# Altium schematic sheet MainShunt.SchDoc
size A4; SheetNumber: 1; SheetTotal: 4
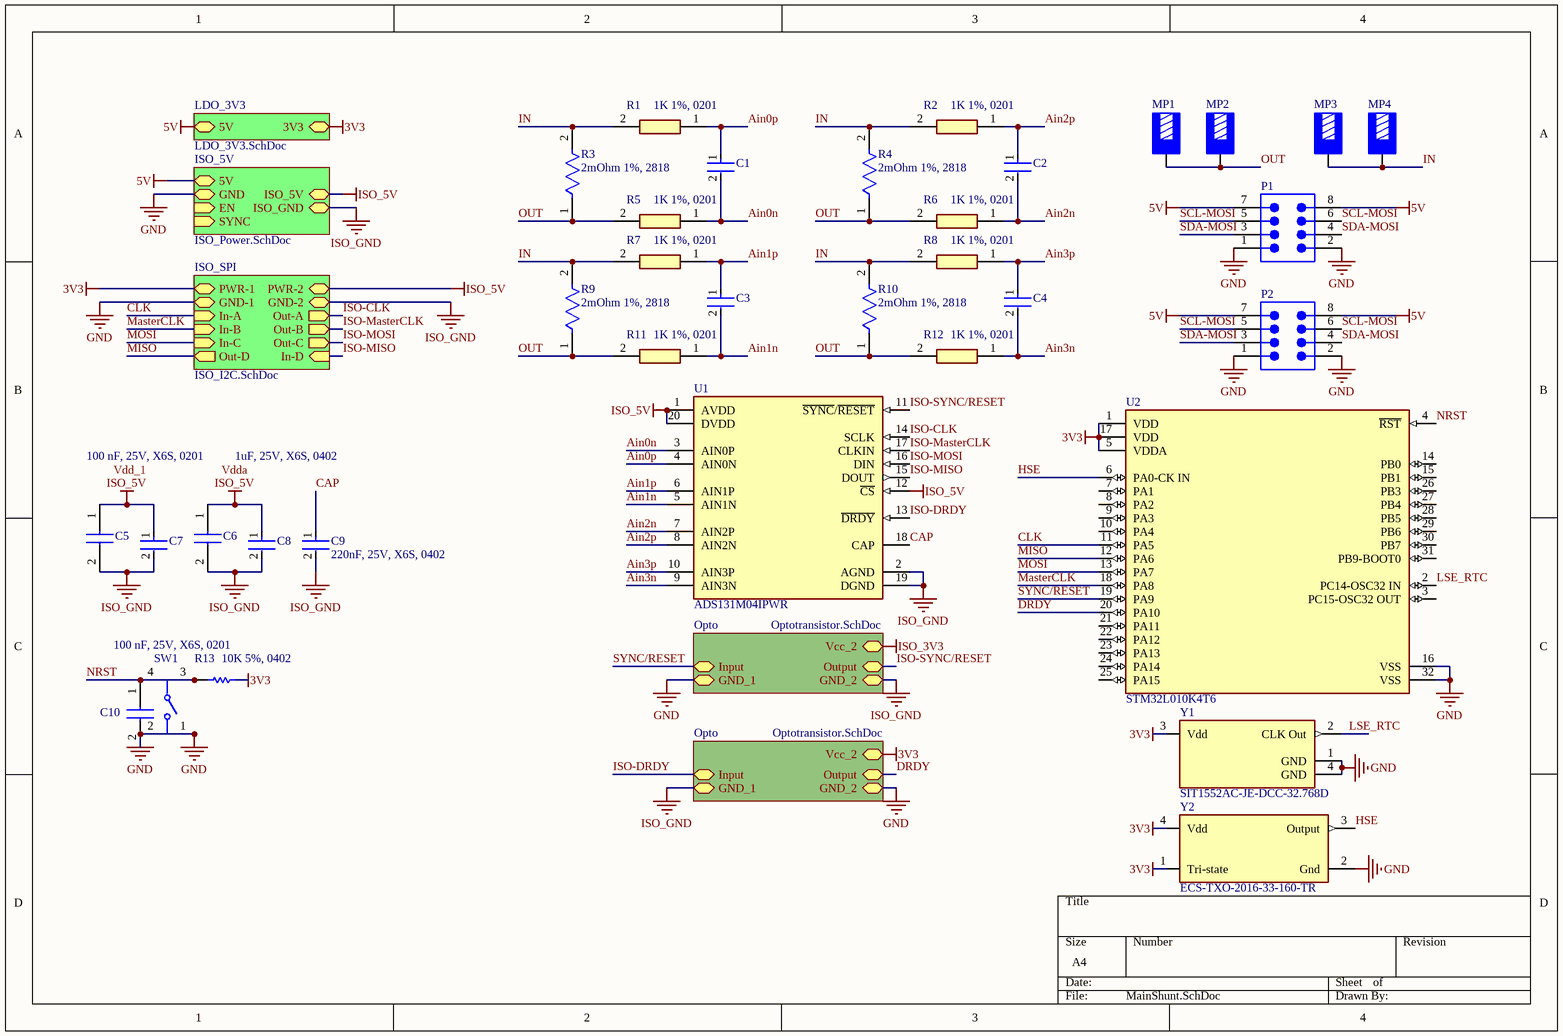
[diagram p0: MainShunt.SchDoc]

## Parts
C1  10nF, 25V, X5R, 0201  [FP-GRM033-0_03-IPC_C]  (value not drawn)
C2  10nF, 25V, X5R, 0201  [FP-GRM033-0_03-IPC_C]  (value not drawn)
C3  10nF, 25V, X5R, 0201  [FP-GRM033-0_03-IPC_C]  (value not drawn)
C4  10nF, 25V, X5R, 0201  [FP-GRM033-0_03-IPC_C]  (value not drawn)
C5  100 nF, 25V, X6S, 0201  [CAPC0603X33N]  (value not drawn)
C6  100 nF, 25V, X6S, 0201  [CAPC0603X33N]  (value not drawn)
C7  1uF, 25V, X6S, 0402  [FP-GRT155-0_1-IPC_A]  (value not drawn)
C8  1uF, 25V, X6S, 0402  [FP-GRT155-0_1-IPC_A]  (value not drawn)
C9  220nF, 25V, X6S, 0402  [FP-C0603-030-0_03-IPC_B]
C10  100 nF, 25V, X6S, 0201  [CAPC0603X33N]  (value not drawn)
MP1  7460307  [7460307_chemical surface]  (value not drawn)
MP2  7460307  [7460307_chemical surface]  (value not drawn)
MP3  7460307  [7460307_chemical surface]  (value not drawn)
MP4  7460307  [7460307_chemical surface]  (value not drawn)
P1  61200821621  [61200821621]  (value not drawn)
P2  61200821621  [61200821621]  (value not drawn)
R1  1K 1%, 0201  [ERJ1GN_(0201)]
R2  1K 1%, 0201  [ERJ1GN_(0201)]
R3  2mOhm 1%, 2818  [FP-WSHP2818-MFG]
R4  2mOhm 1%, 2818  [FP-WSHP2818-MFG]
R5  1K 1%, 0201  [ERJ1GN_(0201)]
R6  1K 1%, 0201  [ERJ1GN_(0201)]
R7  1K 1%, 0201  [ERJ1GN_(0201)]
R8  1K 1%, 0201  [ERJ1GN_(0201)]
R9  2mOhm 1%, 2818  [FP-WSHP2818-MFG]
R10  2mOhm 1%, 2818  [FP-WSHP2818-MFG]
R11  1K 1%, 0201  [ERJ1GN_(0201)]
R12  1K 1%, 0201  [ERJ1GN_(0201)]
R13  10K 5%, 0402  [RESC1005X40X25ML05T05]
SW1  PTS810SJM250SMTRLFS  [FP-PTS810SJM250SMTRLFS-MFG]  (value not drawn)
U1  ADS131M04IPWR  [FP-PW0020A-IPC_A]
U2  STM32L010K4T6  [FP-LQFP32-5V-MFG]
Y1  SIT1552AC-JE-DCC-32.768D  [FP-SiT1552-J-MFG]
Y2  ECS-TXO-2016-33-160-TR  [FP-TXO-2016-MFG]

## Sub-sheets
ISO_5V = ISO_Power.SchDoc: ISO_5V (bidir), 5V (bidir), GND (bidir), ISO_GND (bidir), EN (in), SYNC (in)
ISO_SPI = ISO_I2C.SchDoc: PWR-2 (bidir), PWR-1 (bidir), GND-1 (bidir), GND-2 (bidir), In-A (in), In-B (in), In-C (in), In-D (in), Out-A (out), Out-B (out), Out-C (out), Out-D (out)
LDO_3V3 = LDO_3V3.SchDoc: 3V3 (bidir), 5V (bidir)
Opto = Optotransistor.SchDoc: Output (bidir), Input (bidir), GND_1 (bidir), Vcc_2 (bidir), GND_2 (bidir)
Opto = Optotransistor.SchDoc: Output (bidir), Input (bidir), GND_1 (bidir), Vcc_2 (bidir), GND_2 (bidir)

## Nets
3V3: R13.1 U2.1(VDD) U2.5(VDDA) U2.17(VDD) Y1.3(Vdd) Y2.1(Tri-state) Y2.4(Vdd) ; sheet ISO_SPI/PWR-1, sheet LDO_3V3/3V3, sheet Opto/Vcc_2
5V: P1.7 P1.8 P2.7 P2.8 ; sheet ISO_5V/5V, sheet LDO_3V3/5V
GND: C10.2 P1.1 P1.2 P2.1 P2.2 SW1.1 SW1.2 U2.16(VSS) U2.32(VSS) Y1.1(GND) Y1.4(GND) Y2.2(Gnd) ; sheet ISO_5V/GND, sheet ISO_SPI/GND-1, sheet Opto/GND_1, sheet Opto/GND_2
ISO_3V3: sheet Opto/Vcc_2
ISO_5V: C5.1 C6.1 C7.1 C8.1 U1.1(AVDD) U1.12(~{CS}) U1.20(DVDD) ; sheet ISO_5V/ISO_5V, sheet ISO_SPI/PWR-2
ISO_GND: C5.2 C6.2 C7.2 C8.2 C9.2 U1.2(AGND) U1.19(DGND) ; sheet ISO_5V/ISO_GND, sheet ISO_SPI/GND-2, sheet Opto/GND_2, sheet Opto/GND_1
Ain0n: C1.2 R5.1 U1.3(AIN0P)
Ain0p: C1.1 R1.1 U1.4(AIN0N)
Ain1n: C3.2 R11.1 U1.5(AIN1N)
Ain1p: C3.1 R7.1 U1.6(AIN1P)
Ain2n: C2.2 R6.1 U1.7(AIN2P)
Ain2p: C2.1 R2.1 U1.8(AIN2N)
Ain3n: C4.2 R12.1 U1.9(AIN3N)
Ain3p: C4.1 R8.1 U1.10(AIN3P)
CAP: C9.1 U1.18(CAP)
CLK: U2.11(PA5) ; sheet ISO_SPI/In-A
DRDY: U2.20(PA10) ; sheet Opto/Output
HSE: U2.6(PA0-CK_IN) Y2.3(Output)
IN: MP3.1 MP4.1 R1.2 R2.2 R3.2 R4.2 R7.2 R8.2 R9.2 R10.2
ISO-CLK: U1.14(SCLK) ; sheet ISO_SPI/Out-A
ISO-DRDY: U1.13(~{DRDY}) ; sheet Opto/Input
ISO-MasterCLK: U1.17(CLKIN) ; sheet ISO_SPI/Out-B
ISO-MISO: U1.15(DOUT) ; sheet ISO_SPI/In-D
ISO-MOSI: U1.16(DIN) ; sheet ISO_SPI/Out-C
ISO-SYNC/RESET: U1.11(~{SYNC}/~{RESET}) ; sheet Opto/Output
LSE_RTC: U2.2(PC14-OSC32_IN) Y1.2(CLK_Out)
MasterCLK: U2.18(PA8) ; sheet ISO_SPI/In-B
MISO: U2.12(PA6) ; sheet ISO_SPI/Out-D
MOSI: U2.13(PA7) ; sheet ISO_SPI/In-C
NRST: C10.1 R13.2 SW1.3 SW1.4 U2.4(~{RST})
OUT: MP1.1 MP2.1 R3.1 R4.1 R5.2 R6.2 R9.1 R10.1 R11.2 R12.2
SCL-MOSI: P1.5 P1.6 P2.5 P2.6
SDA-MOSI: P1.3 P1.4 P2.3 P2.4
SYNC/RESET: U2.19(PA9) ; sheet Opto/Input

Not connected (* = marked no-connect by the designer): U2 3(PC15-OSC32_OUT) 7(PA1) 8(PA2) 9(PA3) 10(PA4) 14(PB0) 15(PB1) 21(PA11) 22(PA12) 23(PA13) 24(PA14) 25(PA15) 26(PB3) 27(PB4) 28(PB5) 29(PB6) 30(PB7) 31(PB9-BOOT0)

## Notes on the sheet
- 100 nF, 25V, X6S, 0201
- Vdd_1
- Vdda
- 1uF, 25V, X6S, 0402

## Library data of the parts
C1-C4 = CMP-2010-01269-2: Chip Multilayer Ceramic Capacitors for General Purpose, 0201, 10000pF, X5R, 15%, 10%, 25V; Capacitance: 10nF; Weight: 1.2E-05oz; Tolerance: 10%; Length: 0.6mm; Case Code (Metric): 0603; Min Operating Temperature: -55°C; Lead Free: Lead Free; Mount: Surface Mount; Voltage: 25V; REACH SVHC: No SVHC; Dielectric: X5R; Case Code (Imperial): 0201; Depth: 0.3mm; Packaging: Tape and Reel; Package Quantity: 15000; Case/Package: 0201; Voltage Rating (DC): 25V; Height: 0.3mm; Max Operating Temperature: 85°C; Termination: SMD/SMT; Voltage Rating: 25V; Width: 0.3mm; Thickness: 0.013inch
C5 C6 C10 = GRM033C81E104KE14D: Capacitor; Manufacturer_Name: Murata Electronics; Datasheet Link: https://search.murata.co.jp/Ceramy/image/img/A01X/G101/ENG/GRM033C81E104KE14-01A.pdf; Height: 0.33mm; Manufacturer_Part_Number: GRM033C81E104KE14D; Mouser Part Number: 81-GRM33C81E104KE14D; Mouser Price/Stock: https://www.mouser.co.uk/ProductDetail/Murata-Electronics/GRM033C81E104KE14D?qs=P%2FC4Eoq9CDwxe7d5nXqGrA%3D%3D; Arrow Part Number: GRM033C81E104KE14D; Arrow Price/Stock: https://www.arrow.com/en/products/grm033c81e104ke14d/murata-manufacturing
C7 C8 = CMP-06035-047663-1: Multi-Layer Ceramic Capacitor 1uF 25V X6S ±10% 0402 Paper T/R
C9 = CMP-08246-006007-1: Multilayer Ceramic Capacitors 22nF ±10% 25V X5R SMD 0201; Capacitance: 22nF; Tolerance: 10%; Weight: 6E-06oz; Case Code (Imperial): 0201; Voltage Rating (DC): 25V; RoHS Compliant: Yes; Mount: Surface Mount; Dielectric Material: Ceramic; Termination: SMD/SMT; Packaging: Tape and Reel; Width: 0.3mm; Max Operating Temperature: 85°C; Package Quantity: 15000; Case Code (Metric): 0603; Dielectric: X5R; Lead Free: Lead Free; Height: 0.3mm; Thickness: 0.013inch; Min Operating Temperature: -55°C; Length: 0.024inch; Voltage Rating: 25V; Series: C; Case/Package: 0201
MP1-MP4 = CMP-03913-18187384-1: 7460307 8 Pin Power Element, Copper Zinc Alloy, 160A, M4, Vertical; Number of Contacts: 8; Insulation: Non-Insulated; Width: 9mm; Min Operating Temperature: -55°C; Number of Pins: 8; Contact Material: Copper; RoHS: Compliant; Packaging: Bulk; Thread Size: M4; Termination: Press-Fit; Mount: Through Hole; Material: Brass; Height: 10.5mm; Length: 9mm; Max Operating Temperature: 150°C; Number of Rows: 2; Contact Plating: Tin; NexarPartId: 18187384; Current Rating: 160A; REACH SVHC: Unknown
P1 P2 = CMP-1502-00006-2: NexarPartId: 32855460; Gender: Male; Row Spacing: 2.54mm; Connector Type: Male Pin; Insulation Resistance: 1GΩ; Contact Resistance: 20mΩ; Number of Positions: 8; Current Rating: 3A; Operating Supply Voltage: 250V; Orientation: Vertical; Lead Pitch: 2.54mm; Length: 17.82mm; Max Operating Temperature: 105°C; Mount: Through Hole; Color: Black; Insulation Material: PBT; RoHS: Compliant; Contact Material: Copper; Number of Contacts: 8; Pitch: 2.54mm; Contact Plating: Gold; Min Operating Temperature: -40°C; Number of Pins: 8; Termination: Solder; REACH SVHC: Unknown; Number of Rows: 2
R1 R2 R5-R8 R11 R12 = ERJ-1GNF1001C: Resistor; Manufacturer_Name: Panasonic; Datasheet Link: https://industrial.panasonic.com/cdbs/www-data/pdf/RDA0000/AOA0000C301.pdf; Height: 0.26mm; Manufacturer_Part_Number: ERJ-1GNF1001C; Mouser Part Number: 667-ERJ-1GNF1001C; Mouser Price/Stock: https://www.mouser.co.uk/ProductDetail/Panasonic/ERJ-1GNF1001C?qs=nuXzIS8loXFEaL2ux1uJzQ%3D%3D; Arrow Part Number: ERJ-1GNF1001C; Arrow Price/Stock: https://www.arrow.com/en/products/erj-1gnf1001c/panasonic?utm_currency=USD&region=nac
R3 R4 R9 R10 = CMP-00030-78727543-1: WSHP28182L000FEB Res Metal Strip 2818 0.002 Ohm 1% 10W ±200ppm/C Pad SMD Automotive T/R; Temperature Coefficient: 200ppm/°C; Resistance: 2mΩ; Case/Package: 2818; Packaging: Cut Tape; NexarPartId: 78727543; Composition: Metal Element; Height: 3.43mm; Power Rating: 10W; Min Operating Temperature: -65°C; Schedule B: 8533210045, 8533210045; Max Operating Temperature: 170°C; Tolerance: 1%; RoHS: Non-Compliant
R13 = CMP-2002-00433-1: Part Number: ERJ-2GEJ103X; Manufacturer: Panasonic
SW1 = CMP-10040-000001-2: SWITCH TACTILE SPST-NO 0.05A 16V; Throw Configuration: SPST; Operating Force: 160gf; Actuator Type: Standard; Switch Travel: 0.15mm; Switch Function: Off-Mom; Max Current Rating: 50mA; Mechanical Life: 150000Cycles; Illumination Type: Non-Illuminated; Package Quantity: 2900; Depth: 4.6mm; Mount: Surface Mount; Packaging: Tape and Reel; Length: 3.2mm; RoHS Compliant: Yes; Case/Package: SMD/SMT; Voltage Rating (DC): 16V; Min Operating Temperature: -40°C; Termination: J-Bend; Lead Free: Lead Free; Contact Plating: Silver; Orientation: Straight; Max Operating Temperature: 85°C; Current Rating: 50mA; Color: Black
U1 = CMP-04860-000051-1: IC ADC 24BIT SIGMA-DELTA 20TSSOP
U2 = CMP-12105-000001-1: 16/32-BITS MICROS; Manufacturer: STMicroelectronics; Number Of Cores: 1; Core Architecture: ARM Cortex-M0+; Number Of Adc Channels: 10; Data Bus Width: 32bits; Frequency: 32MHz; Number Of I/Os: 26; Memory Size: 16KBytes; Max Junction Temp: +105°C; Memory Type: FLASH; Number Of Uart Channels: 2; Ram Size: 2KBytes; Number Of Timers/Counters: 5; Nominal Supply Current: 22-5400uA; Interface: I2C,SPI,UART,USART,SMBus; Min Supply Voltage: 1.8V; Max Supply Voltage: 3.6V; Standoff Height: 0.05mm; ComponentLink2Description: Datasheet; Temperature Range High: +85°C; Device Class L2: Embedded Processors and Controllers; Package: LQFP32-5V; Manufacturer Part Number: STM32L010K4T6; Ambient Temperature Range Low: -40°C; RoHS: TRUE; Digikey Description: 16/32-BITS MICROS; Lead Free: Yes; Category: IC; Height: 1.6mm; ComponentLink2URL: https://www.st.com/resource/en/datasheet/stm32l010f4.pdf; Temperature Range Low: -40°C; Automotive: No; Device Class L3: Microcontrollers; Device Class L1: Integrated Circuits (ICs); Octopart: https://octopart.com/stm32l010k4t6-stmicroelectronics-96493833; Temperature: -40°C to +85°C; Number Of Spi Channels: 1; Number Of I2C Channels: 1; Ambient Temperature Range High: +85°C; Number Of A/D Converters: 1
Y1 = CMP-25159-260295-1: MEMS OSC TCXO 32.7680KHZ LVCMOS; Frequency Stability: 5ppm; Frequency: 32.768kHz; Min Operating Temperature: 0°C; Length: 0.061inch; Mount: Surface Mount; Max Operating Temperature: 70°C; Width: 0.033inch; RoHS Compliant: Yes; Series: SiT1552; Packaging: Cut Tape; Height: 0.024inch
Y2 = CMP-40224-000008-1: XTAL OSC TCXO 16MHZ 3.3V SMD; Manufacturer: ECS; Max Supply Voltage: 3.63V; Max Supply Current: 7mA; Stability: 2ppm; Min Supply Voltage: 2.97V; Load Capacitance: 15pF; Frequency: 16MHz; Device Class L1: Passive Components; Manufacturer Part Number: ECS-TXO-2016-33-160-TR; Digikey Description: XTAL OSC TCXO 16MHZ 3.3V SMD; Device Class L3: Oscillators; Category: Crys; Lead Free: Yes; Temperature: -40°C to +85°C; RoHS: TRUE; ComponentLink2Description: Datasheet; Octopart: https://octopart.com/ecs-txo-2016-33-160-tr-ecs+international-102811109; ComponentLink2URL: https://ecsxtal.com/store/pdf/ECS-TXO-2016.pdf; Temperature Range High: +85°C; Height: 0.8mm; Device Class L2: Crystals / Oscillators; Package: TXO-2016; Temperature Range Low: -40°C; Series: TXO-2016; Automotive: No